# EAGLE design HCPL-7xx (EAGLE 5.11)
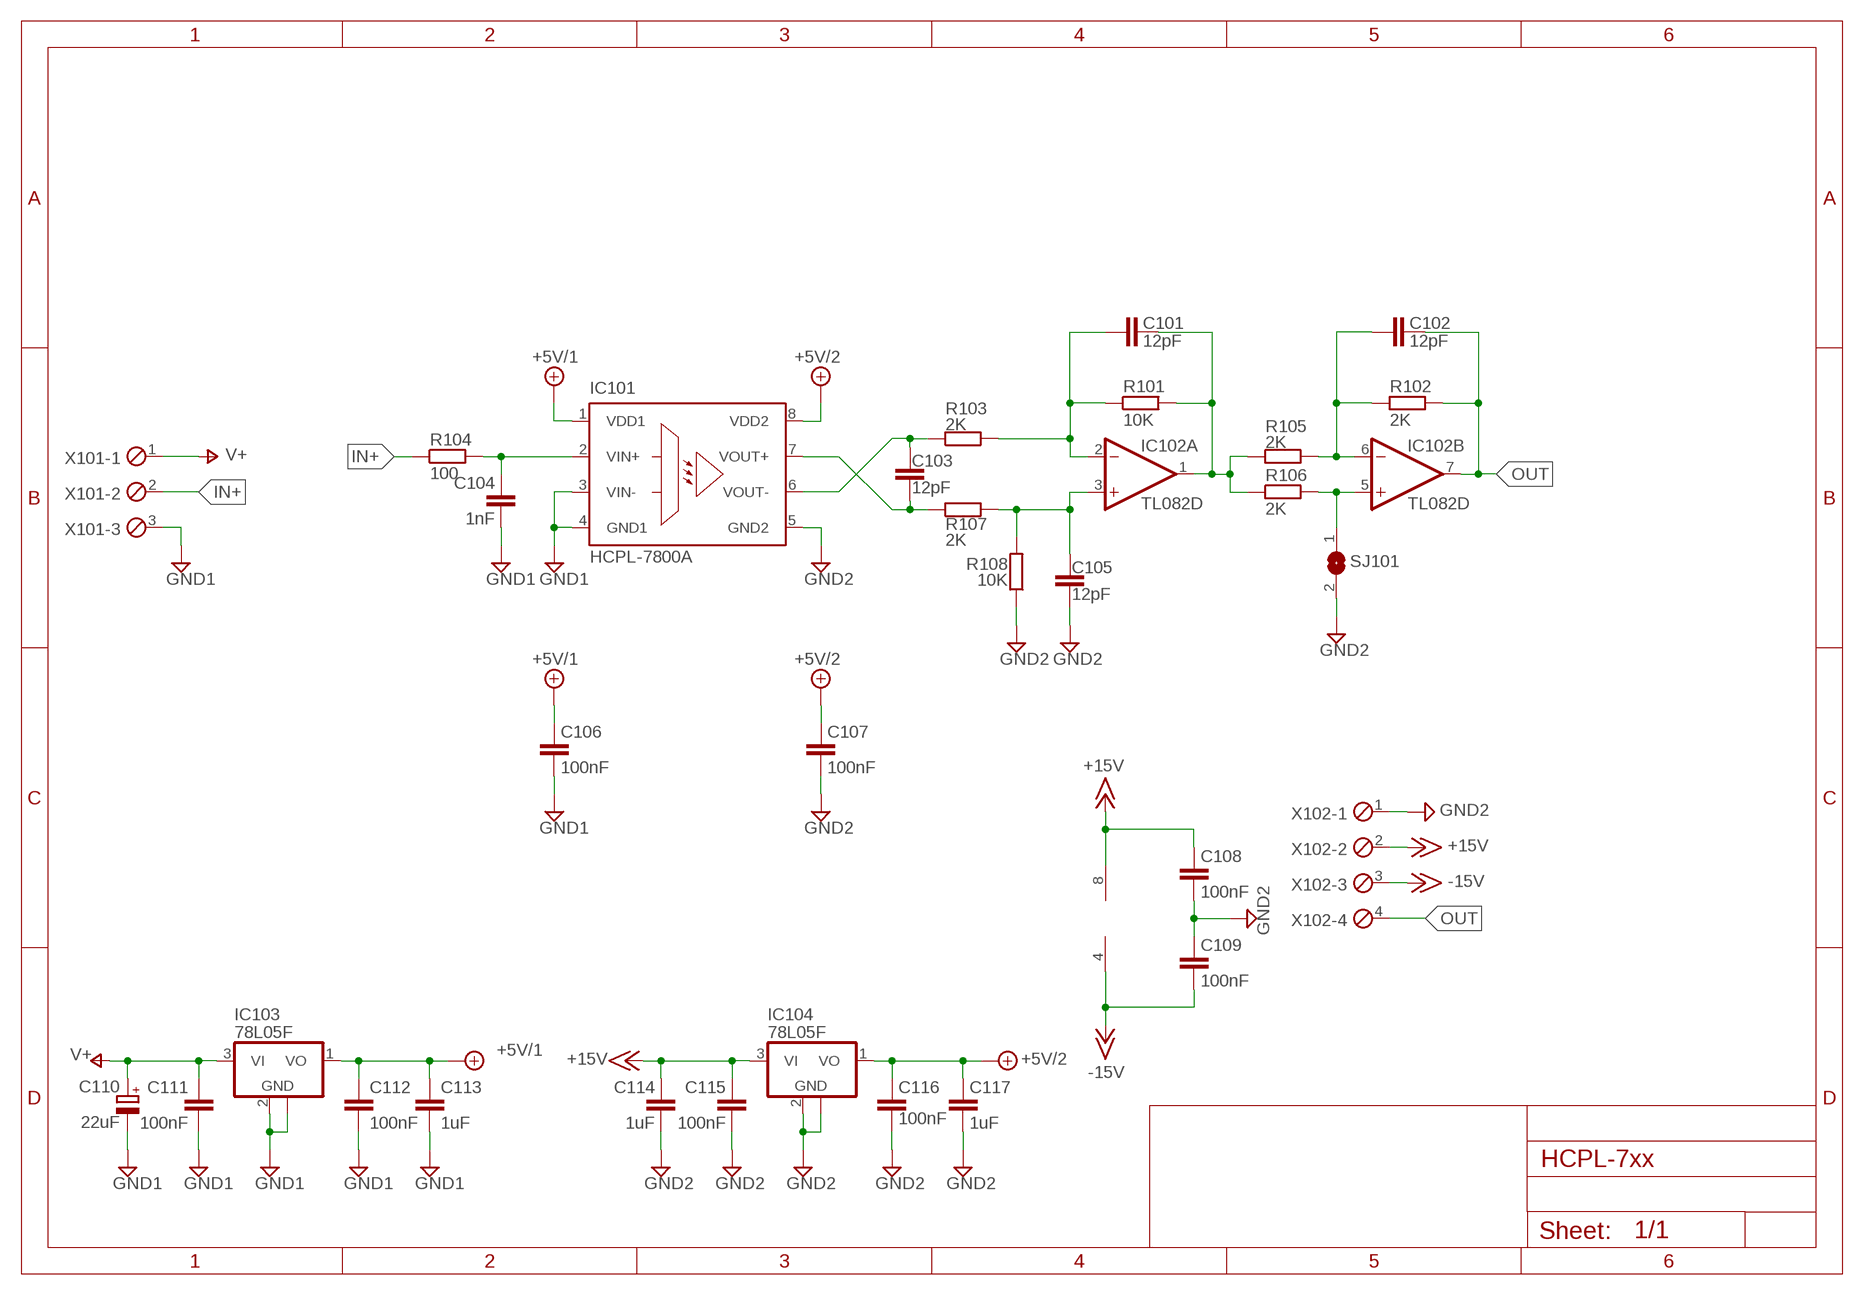
[diagram p0: schematic, sheet 1]

## Parts
C101  12pF  C-EUC0603  [C0603]
C102  12pF  C-EUC0603  [C0603]
C103  12pF  C-EUC0603  [C0603]
C104  1nF  C-EUC0603  [C0603]
C105  12pF  C-EUC0603  [C0603]
C106  100nF  C-EUC0603  [C0603]
C107  100nF  C-EUC0603  [C0603]
C108  100nF  C-EUC0603  [C0603]
C109  100nF  C-EUC0603  [C0603]
C110  22uF  CPOL-EU153CLV-0505  [153CLV-0505]
C111  100nF  C-EUC0603  [C0603]
C112  100nF  C-EUC0603  [C0603]
C113  1uF  C-EUC0603  [C0603]
C114  1uF  C-EUC0603  [C0603]
C115  100nF  C-EUC0603  [C0603]
C116  100nF  C-EUC0603  [C0603]
C117  1uF  C-EUC0603  [C0603]
IC101  HCPL-7800A  [DIP8]
IC102  TL082D  [SO08]
IC103  78L05F  [SOT89]
IC104  78L05F  [SOT89]
R101  10K  R-EU_R0603  [R0603]
R102  2K  R-EU_R0603  [R0603]
R103  2K  R-EU_R0603  [R0603]
R104  100  R-EU_R0603  [R0603]
R105  2K  R-EU_R0603  [R0603]
R106  2K  R-EU_R0603  [R0603]
R107  2K  R-EU_R0603  [R0603]
R108  10K  R-EU_R0603  [R0603]
SJ101  SJ  [SJ]
X101  MPT3  [3POL254]
X102  MPT4  [4POL254]

## Nets
+5V/1: C106.1 C112.1 C113.1 IC101.1(VDD1) IC103.1(VO)
+5V/2: C107.1 C116.1 C117.1 IC101.8(VDD2) IC104.1(VO)
+15V: C108.1 C114.1 C115.1 IC102.8(P:V+) IC104.3(VI) X102.2
-15V: C109.2 IC102.4(P:V-) X102.3
GND1: C104.2 C106.2 C110.- C111.2 C112.2 C113.2 IC101.3(VIN-) IC101.4(GND1) IC103.2(GND) IC103.2@1(GND) X101.3
GND2: C105.1 C107.2 C108.2 C109.1 C114.2 C115.2 C116.2 C117.2 IC101.5(GND2) IC104.2(GND) IC104.2@1(GND) R108.1 SJ101.2 X102.1
IN+: R104.1 X101.2
N$1: C101.1 IC102.2(A:-IN) R101.1 R103.2
N$2: C101.2 IC102.1(A:OUT) R101.2 R105.1 R106.1
N$3: C105.2 IC102.3(A:+IN) R107.2 R108.2
N$10: C103.1 IC101.7(VOUT+) R107.1
N$11: C103.2 IC101.6(VOUT-) R103.1
N$14: C102.1 IC102.6(B:-IN) R102.1 R105.2
N$15: C104.1 IC101.2(VIN+) R104.2
N$16: IC102.5(B:+IN) R106.2 SJ101.1
OUT: C102.2 IC102.7(B:OUT) R102.2 X102.4
V+: C110.+ C111.1 IC103.3(VI) X101.1

## Library data of the parts
C101-C109 C111-C117 = rcl:C-EU: CAPACITOR, European symbol
C110 = rcl:CPOL-EU: POLARIZED CAPACITOR, European symbol
IC101 = avago:HCPL-7800: Isolation Amplifer Source: http://www.avagotech.com/docs/AV02-0410EN; MF: AGILENT TECHNOLOGIES; MPN: HCPL-7800A-000E; OC_FARNELL: 8550026; OC_NEWARK: 88H7847
IC102 = linear:TL082: OP AMP
IC103 IC104 = linear:78L*: POSITOIV-VOLTAGE REGULATORS Output up to 100 mA Source: http://focus.ti.com/lit/ds/symlink/ua78l05.pdf
R101-R108 = rcl:R-EU_: RESISTOR, European symbol
SJ101 = jumper:SJ: SMD solder JUMPER
X101 = con-phoenix-254:MPT3: PHOENIX CONNECTOR; OC_FARNELL: unknown; OC_NEWARK: unknown
X102 = con-phoenix-254:MPT4: PHOENIX CONNECTOR; OC_FARNELL: unknown; OC_NEWARK: unknown

## Board
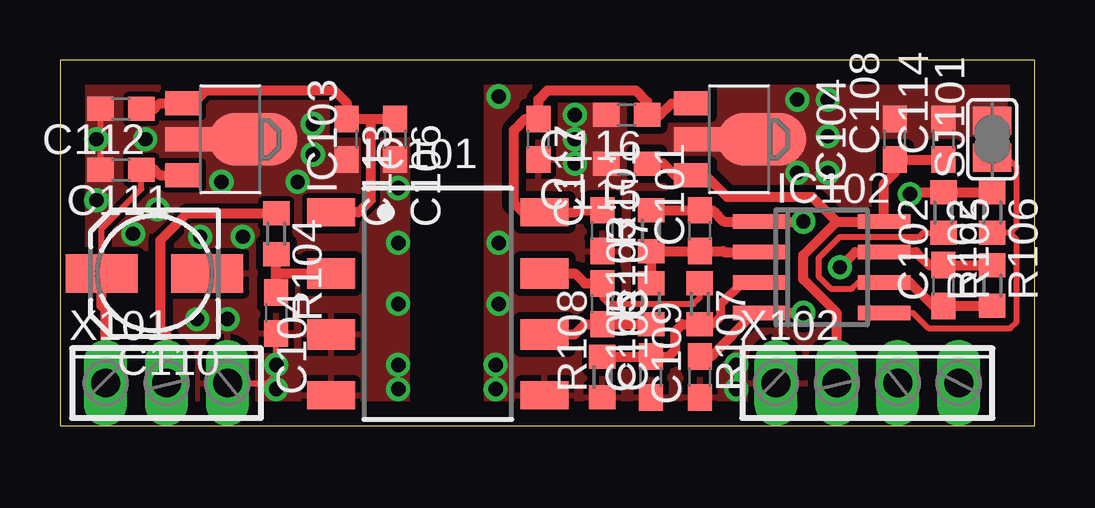
[diagram p1: board, top side]
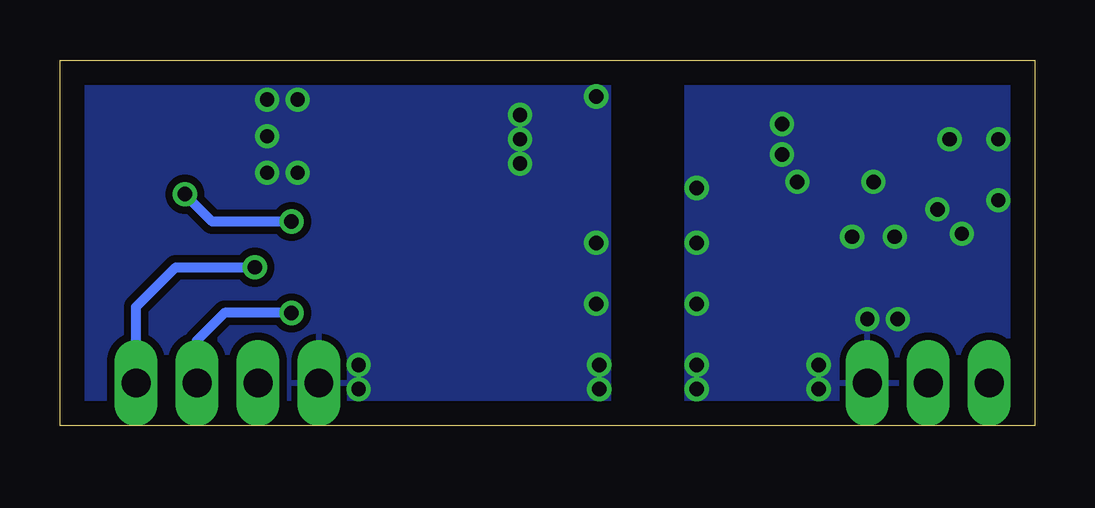
[diagram p2: board, bottom side, seen from below]

Size 40.64 x 15.24 mm. Coordinates in mm from the lower left corner, seen from the top.
Outline: 0,0 40.64,0 40.64,15.24 0,15.24 0,0
Copper layers (1*16): Top 0.035mm / dielectric 1.5mm / Bottom 0.035mm
Design rules "default *": minimum track width 10mil, minimum drill 24mil, track to track 8mil, track to pad 8mil, pad to pad 8mil, via to via 8mil, smd to smd 8mil, copper to edge 40mil, drill to drill 8mil, minimum pad ring 10mil, minimum via ring 8mil, stop-mask expansion 4mil, vias tented up to drill 0mil, thermal gap 10mil

### Footprints (pad centres in the part's own frame; a part is rotated, then mirrored left to right if it is on the bottom)
C0603 = smd 1.1 x 1: 1 -0.85,0; 2 0.85,0
153CLV-0505 = smd 3 x 1.6: + 2.2,0; - -2.2,0
DIP8 = smd 1.16 x 2: 1 -3.81,-4.45; 4 3.81,-4.45; 5 3.81,4.45; 8 -3.81,4.45 | smd 1.27 x 2: 2 -1.27,-4.45; 3 1.27,-4.45; 6 1.27,4.45; 7 -1.27,4.45
SO08 = smd 0.6 x 2.2: 1 -1.905,-2.6; 2 -0.635,-2.6; 3 0.635,-2.6; 4 1.905,-2.6; 5 1.905,2.6; 6 0.635,2.6; 7 -0.635,2.6; 8 -1.905,2.6
SOT89 = smd 1 x 1.5: 1 -1.499,-1.981; 3 1.499,-1.981 | smd 1 x 2: 2 0,-1.727 | smd 2.2 x 3.7: 2@1 0,0.94
R0603 = smd 1 x 1.1: 1 -0.85,0; 2 0.85,0
SJ = smd 1.168 x 1.6: 1 -0.762,0; 2 0.762,0
3POL254 = drill 1.2 long: 1 -2.54,0; 2 0,0; 3 2.54,0
4POL254 = drill 1.2 long: 1 -3.81,0; 2 -1.27,0; 3 1.27,0; 4 3.81,0

### Placement (x,y rotation side)
C101  26.67,8.13 90 top
C102  36.83,5.84 90 top
C103  22.61,5.08 270 top
C104  9.02,4.7 270 top
C105  24.64,2.03 90 top
C106  13.97,11.94 270 top
C107  22.61,8.13 270 top
C108  34.8,11.94 90 top
C109  26.67,2.03 90 top
C110  3.94,6.35 180 top
C111  2.54,10.67 180 top
C112  2.54,13.21 180 top
C113  11.94,11.94 270 top
C114  36.83,11.94 90 top
C115  23.62,10.92 180 top
C116  23.62,12.95 180 top
C117  19.94,11.94 270 top
IC101  15.75,5.08 270 top
IC102  31.75,6.6 270 top
IC103  7.11,11.94 270 top
IC104  28.32,11.94 270 top
R101  24.64,8.13 90 top
R102  38.86,5.84 90 top
R103  24.64,5.08 90 top
R104  9.02,8 270 top
R105  36.83,8.89 270 top
R106  38.86,8.89 270 top
R107  26.67,5.08 270 top
R108  22.61,2.03 90 top
SJ101  38.86,11.94 90 top
X101  4.45,1.78 0 top
X102  33.66,1.78 0 top

### Tracks (layer width: path | path; a pad name or v marks a point on that pad's centre or on a via)
+5V/1
  Top 0.406: 12.95,12.79 C113.1 11.94,13.46 11.43,13.97 6.1,13.97 5.56,13.44 IC103.1 4.17,13.44 3.94,13.21 C112.1 | 12.95,12.79 C106.1 | IC101.1 12.45,8.89 12.95,9.4 12.95,12.79
+5V/2
  Top 0.406: IC104.1 25.5,13.44 25.02,12.95 C116.1 24.47,13.5 24,13.97 20.32,13.97 19.94,13.59 C117.1 19.39,12.79 18.92,12.32 18.92,9.27 19.3,8.89 IC101.8 21.46,8.89 21.55,8.98 C107.1
+15V
  Top 0.406: X102.2 32.38,4.7 30.99,6.1 30.99,7.11 32.38,8.51 | 32.38,8.51 IC102.8 34.35,10.09 34.8,10.54 C108.1 C114.1 | 32.38,8.51 31.37,9.53 27.81,9.53 26.9,10.44 IC104.3 25.63,10.44 25.15,10.92 C115.1
-15V  (via drill 0.6)
  Top 0.406: v30.99,4.7 IC102.4 28.96,4.7 27.14,2.88 C109.2
  Bottom 0.406: X102.3 34.92,3.56 33.78,4.7 v30.99,4.7
GND1  (via drill 0.6)
  Top 0.254: C111.2 C112.2 | X101.3 8.64,1.78 9.02,2.16 C104.2
  other vias: 6.99,4.45 9.02,1.52 14.1,1.52 14.1,5.08 14.1,7.62 14.1,9.91 1.52,11.94 5.84,7.87 5.71,4.45 1.52,9.4 3.05,8 4.06,9.02 9.91,10.16 6.73,10.16 10.54,11.3 10.54,12.57 14.1,2.54 9.02,2.54 7.62,7.87 3.56,11.94
  pour Top (isolate 0.305): 0,0 14.48,0 14.48,15.24 0,15.24
  pour Top (no thermals): 1.02,8.13 1.02,15.24 14.48,15.24 14.48,8.13
  pour Bottom (isolate 0.305): 0,0 14.48,0 14.48,15.24 0,15.24
GND2  (via drill 0.6)
  other vias: 30.73,13.59 32,13.59 18.29,13.72 18.16,1.52 18.29,7.62 18.29,5.08 21.46,10.92 32,12.06 32,10.54 21.46,12.95 30.73,10.54 28.19,1.52 28.19,2.54 21.46,11.94 18.16,2.54
  pour Top (isolate 0.305): 17.78,0 40.64,0 40.64,15.24 17.78,15.24
  pour Bottom (isolate 0.305): 17.78,15.24 40.64,15.24 40.64,0 17.78,0
  pour Top (isolate 0.305, no thermals): 21.08,9.4 21.08,15.24 39.37,15.24 39.37,8.76 21.08,8.76
IN+
  Top 0.406: R104.1 5.29,8.85 4.19,7.75 4.19,4.06 4.45,3.81 X101.2
N$1
  Top 0.406: R103.2 R101.1 C101.1 27.65,7.28 27.69,7.24 IC102.2
N$2  (via drill 0.6)
  Top 0.406: v30.99,8.51 IC102.1 27.69,8.51 27.22,8.98 C101.2 R101.2 | R106.1 R105.1 35.52,9.74 v35.43,9.65
  Bottom 0.406: v30.99,8.51 34.29,8.51 v35.43,9.65
N$3
  Top 0.381: R107.2 27.22,4.23 27.56,4.57 27.56,5.08 28.45,5.97 IC102.3
  Top 0.406: R108.2 C105.2 25.36,2.88 25.65,3.17 25.65,3.94 25.95,4.23 R107.2
N$10
  Top 0.254: C103.1 22.61,5.33 22.86,5.08 26.42,5.08 26.67,5.33 R107.1
  Top 0.406: C103.1 21.88,5.93 21.46,6.35 IC101.7
N$11
  Top 0.406: R103.1 C103.2 21.88,4.23 21.46,3.81 IC101.6
N$14
  Top 0.254: IC102.6 33.27,5.97 33.02,5.71 32.13,5.71 31.62,6.22 31.62,6.99 32.51,7.87 35.81,7.87 35.98,8.04 R105.2
  Top 0.406: R102.1 C102.1 36.41,4.99 35.43,5.97 IC102.6
N$15
  Top 0.406: C104.1 9.02,6.35 | 9.02,6.35 R104.2 | 9.02,6.35 IC101.2
N$16
  Top 0.254: IC102.5 35.56,4.7 36.2,4.06 39.62,4.06 39.88,4.32 39.88,7.75 39.59,8.04 | 39.59,8.04 R106.2 | SJ101.1 39.5,11.18 39.88,10.79 39.88,8.33 39.59,8.04
OUT  (via drill 0.6)
  Top 0.406: R102.2 C102.2 36.23,6.69 35.69,7.24 IC102.7 33.15,7.24 v32.51,6.6
  Bottom 0.406: v32.51,6.6 35.81,6.6 37.47,4.95 X102.4
V+
  Top 0.254: C110.+ 1.74,8.21 3.39,9.87 C111.1
  Top 0.406: IC103.3 4.17,10.44 3.94,10.67 C111.1 | C110.+ 1.74,4.99 1.91,4.83 X101.1